# Altium schematic sheet GPRS.SchDoc
size A3
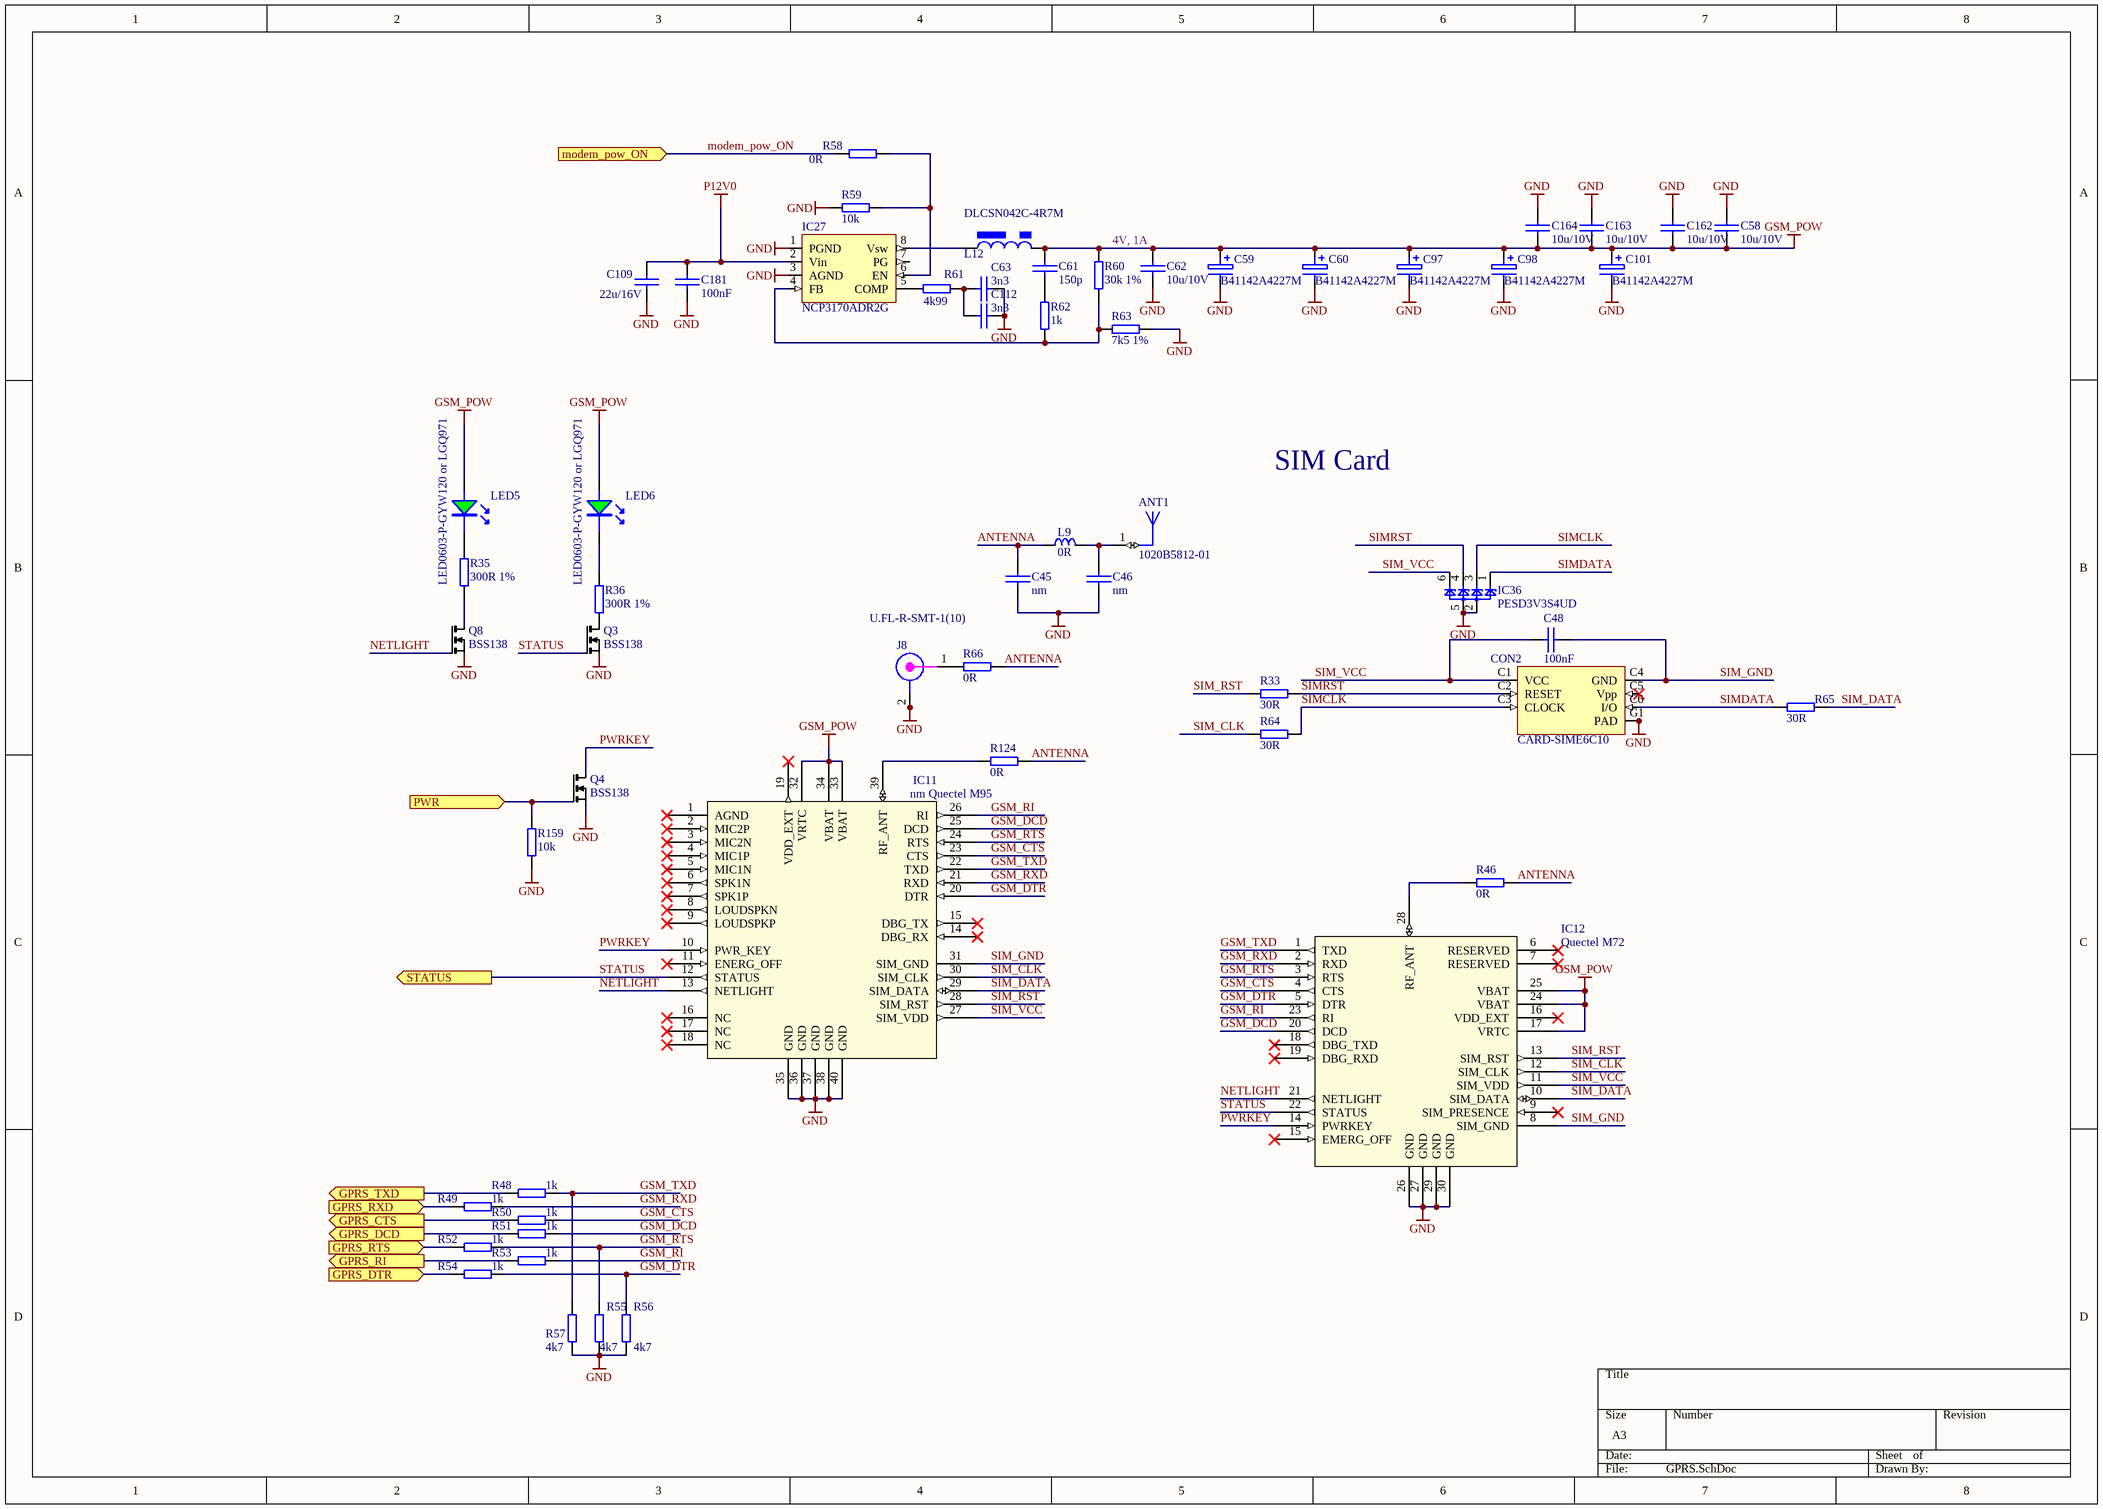
[diagram p0: GPRS.SchDoc]

## Parts
ANT1  1020B5812-01  [ANT27.3X7.9]
C45  nm  [0603C]
C46  nm  [0603C]
C48  100nF  [0402C]
C58  10u/10V  [0805C]
C59  B41142A4227M  [CAP_SMT_EL_5mm_C]
C60  B41142A4227M  [CAP_SMT_EL_5mm_C]
C61  150p  [0603C]
C62  10u/10V  [0805C]
C63  3n3  [0603C]
C97  B41142A4227M  [CAP_SMT_EL_5mm_C]
C98  B41142A4227M  [CAP_SMT_EL_5mm_C]
C101  B41142A4227M  [CAP_SMT_EL_5mm_C]
C109  22u/16V  [1206C]
C112  3n3  [0603C]
C162  10u/10V  [0805C]
C163  10u/10V  [0805C]
C164  10u/10V  [0805C]
C181  100nF  [0402C]
CON2  CARD-SIME6C10  [CON_CARD-SIME6C10]
IC11  nm Quectel M95  [QUECTEL M95]
IC12  Quectel M72  [Quectel M72 GSM Module]
IC27  NCP3170ADR2G  [so-8]
IC36  PESD3V3S4UD  [SOT457]
J8  U.FL-R-SMT-1(10)  [CON_UFL_HIROSE_RECEPTACLE]
L9  0R  [INDC1608X100N]
L12  DLCSN042C-4R7M  [L_DLCSN042C]
LED5  LED0603-P-GYW120 or LGQ971  [led_0603G]
LED6  LED0603-P-GYW120 or LGQ971  [led_0603G]
Q3  BSS138  [SOT-23]
Q4  BSS138  [SOT-23]
Q8  BSS138  [SOT-23]
R33  30R  [0603R]
R35  300R 1%  [0603R]
R36  300R 1%  [0603R]
R46  0R  [0603R]
R48  1k  [0402R]
R49  1k  [0402R]
R50  1k  [0402R]
R51  1k  [0402R]
R52  1k  [0402R]
R53  1k  [0402R]
R54  1k  [0402R]
R55  4k7  [0402R]
R56  4k7  [0402R]
R57  4k7  [0402R]
R58  0R  [0603R]
R59  10k  [0402R]
R60  30k 1%  [0603R]
R61  4k99  [0603R]
R62  1k  [0402R]
R63  7k5 1%  [0603R]
R64  30R  [0603R]
R65  30R  [0603R]
R66  0R  [0603R]
R124  0R  [0603R]
R159  10k  [0402R]

## Ports
GPRS_CTS (out), GPRS_DCD (out), GPRS_DTR (in), GPRS_RI (out), GPRS_RTS (in), GPRS_RXD (in), GPRS_TXD (out), modem_pow_ON (in), PWR (in), STATUS (out)

## Nets
GND: C45.2 C46.2 C58.1 C59.2 C60.2 C62.2 C63.2 C97.2 C98.2 C101.2 C109.2 C112.2 C162.1 C163.1 C164.1 C181.1 CON2.G1(PAD) CON2.G2(GND) CON2.G3(GND) CON2.G4(GND) IC11.35(GND) IC11.36(GND) IC11.37(GND) IC11.38(GND) IC11.40(GND) IC12.26(GND) IC12.27(GND) IC12.29(GND) IC12.30(GND) IC27.1(PGND) IC27.3(AGND) IC36.2 IC36.5 J8.2 J8.2a(GND) Q3.2(S) Q4.2(S) Q8.2(S) R55.1 R56.1 R57.1 R59.1 R63.1 R159.2
GSM_POW: C58.2 C59.1 C60.1 C61.1 C62.1 C97.1 C98.1 C101.1 C162.2 C163.2 C164.2 IC11.32(VRTC) IC11.33(VBAT) IC11.34(VBAT) IC12.17(VRTC) IC12.24(VBAT) IC12.25(VBAT) L12.2 LED5.A LED6.A R60.2
P12V0: C109.1 C181.2 IC27.2(Vin)
ANTENNA: C45.1 L9.1 R46.1 R66.1 R124.1
GPRS_CTS: R50.1 ; port GPRS_CTS
GPRS_DCD: R51.1 ; port GPRS_DCD
GPRS_DTR: R54.1 ; port GPRS_DTR
GPRS_RI: R53.1 ; port GPRS_RI
GPRS_RTS: R52.1 ; port GPRS_RTS
GPRS_RXD: R49.1 ; port GPRS_RXD
GPRS_TXD: R48.1 ; port GPRS_TXD
GSM_CTS: IC11.23(CTS) IC12.4(CTS) R50.2
GSM_DCD: IC11.25(DCD) IC12.20(DCD) R51.2
GSM_DTR: IC11.20(DTR) IC12.5(DTR) R54.2 R56.2
GSM_RI: IC11.26(RI) IC12.23(RI) R53.2
GSM_RTS: IC11.24(RTS) IC12.3(RTS) R52.2 R55.2
GSM_RXD: IC11.21(RXD) IC12.2(RXD) R49.2
GSM_TXD: IC11.22(TXD) IC12.1(TXD) R48.2 R57.2
modem_pow_ON: R58.1 ; port modem_pow_ON
NETLIGHT: IC11.13(NETLIGHT) IC12.21(NETLIGHT) Q8.1(G)
PWR: Q4.1(G) R159.1 ; port PWR
PWRKEY: IC11.10(PWR_KEY) IC12.14(PWRKEY) Q4.3(D)
SIM_CLK: IC11.30(SIM_CLK) IC12.12(SIM_CLK) R64.1
SIM_DATA: IC11.29(SIM_DATA) IC12.10(SIM_DATA) R65.1
SIM_GND: C48.2 CON2.C4(GND) IC11.31(SIM_GND) IC12.8(SIM_GND)
SIM_RST: IC11.28(SIM_RST) IC12.13(SIM_RST) R33.2
SIM_VCC: C48.1 CON2.C1(VCC) IC11.27(SIM_VDD) IC12.11(SIM_VDD) IC36.6
SIMCLK: CON2.C3(CLOCK) IC36.3 R64.2
SIMDATA: CON2.C6(I/O) IC36.1 R65.2
SIMRST: CON2.C2(RESET) IC36.4 R33.1
STATUS: IC11.12(STATUS) IC12.22(STATUS) Q3.1(G) ; port STATUS
NetANT1_1: ANT1.1(FEED) C46.1 L9.2
NetC61_2: C61.2 R62.1
NetC63_1: C63.1 C112.1 R61.1
NetIC11_39: IC11.39(RF_ANT) R124.2
NetIC12_28: IC12.28(RF_ANT) R46.2
NetIC27_4: IC27.4(FB) R60.1 R62.2 R63.2
NetIC27_5: IC27.5(COMP) R61.2
NetIC27_6: IC27.6(EN) R58.2 R59.2
NetIC27_8: IC27.8(Vsw) L12.1
NetJ8_1: J8.1 R66.2
NetLED5_K: LED5.K R35.2
NetLED6_K: LED6.K R36.2
NetQ3_3: Q3.3(D) R36.1
NetQ8_3: Q8.3(D) R35.1

Not connected (* = marked no-connect by the designer): CON2 C5(Vpp)*; IC11 1(AGND)* 2(MIC2P)* 3(MIC2N)* 4(MIC1P)* 5(MIC1N)* 6(SPK1N)* 7(SPK1P)* 8(LOUDSPKN)* 9(LOUDSPKP)* 11(ENERG_OFF)* 14(DBG_RX)* 15(DBG_TX)* 16(NC)* 17(NC)* 18(NC)* 19(VDD_EXT)*; IC12 6(RESERVED)* 7(RESERVED)* 9(SIM_PRESENCE)* 15(EMERG_OFF)* 16(VDD_EXT)* 18(DBG_TXD)* 19(DBG_RXD)*; IC27 7(PG)

## Notes on the sheet
- 4V, 1A
- SIM Card

## Library data of the parts
ANT1 = 1020B5812-01: Flavus GSM Snap-In Antenna, 800/900/1800/1900 MHz, 0.8mm PCB Thickness; PCB_Layout: Complies with manufacturer's recommendation.; Published: 30-May-2008; DatasheetVersion: AE030090-C; PackageVersion: Feb-2007; PackageReference: ANT27.3X7.9; Publisher: Altium Limited; PackageDescription: Snap-In Antenna, Plastic; Body 27.3 x 7.9 mm (LxW); ComponentLink1Description: Manufacturer Link; ComponentLink1URL: http://www.antenova.com/; ComponentLink2Description: Datasheet; ComponentLink2URL: http://www.antenova.com/?id=855&pv=1&lang=1
C45 C46 C61 C63 C112 = CAP_SMD_0603: Capacitor SMD
  C45 C46: Supplier 1: Digi-Key; Supplier Part Number 1: 490-1524-2-ND
C48 C181 = CAP_SMD_0402: Capacitor SMD; Supplier 1: Newark; Supplier Part Number 1: 14T3275
C58 C62 C162-C164 = CAP_SMD: Capacitor SMD
C59 C60 C97 C98 C101 = CAP_ELECTRO_SMD_C: Electrolytic Capacitor
C109 = CAP_SMD_1206: Capacitor SMD; Supplier 1: Newark; Supplier Part Number 1: 90R7810
CON2 = CON_CARD-SIME6C10: Sim Card Holder (Maritex)
IC11 = Quectel M95: GSM Module
IC12 = Quectel M72: GSM Module
IC27 = PWM_NCP3170: 4.5V to 18V, 3A synch buck
IC36 = D_TVS_PESD3V3S4UD: 3.3V TVS
J8 = CON_UFL_SMD: UFL; Supplier 1: Newark; Supplier Part Number 1: 50P8856
L9 = IND0603_WURTH_74279266: Inductor; Part Description: SMD EMI Suppression Chip Bead Ferrite (WE-CBF Serie); Manufacturer: WURTH ELEKTRONIK; Value: 1k@100MHz; Power: 200mA; Resistance: 0.6R; Tolerance: ±25%; Table: Inductors SMD; Part Number: IND0603_WURTH_74279266; Component Kind: Standard; Component Type: Standard; Pin Count: 2; Status: None; Manufacturer Part Number: 74279266; Case: 0603; Mounted: Yes; Socket: No; SMD: Yes; ComponentHeight: 1mm; HelpURL: \\cern.ch\dfs\Applications\Altium\Datasheets\IND0603_WURTH_74279266.pdf; Author: CERN DEM JLC; CreateDate: 2011-03-08; LatestRevisionDate: 2011-03-08
L12 = L_POWER_DLCSN042C: inductor (Maritex)
LED5 LED6 = LED_0603G: LED 0603 green; Supplier 1: Newark; Supplier Part Number 1: 05M0493
Q3 Q4 Q8 = Q_BSS138
R33 R46 R58 R59 R64-R66 R124 = RES_SMD: SMD Resistor
R35 R36 R60 R61 R63 = RES_0603: SMD Resistor
  R35 R36: Supplier 1: Newark; Supplier Part Number 1: 39K0073
R48-R57 R62 R159 = RES_0402: SMD Resistor; Supplier 1: Newark; Supplier Part Number 1: 59M6691